# EAGLE schematic Dual_Drive_4 (EAGLE 9.6.2)
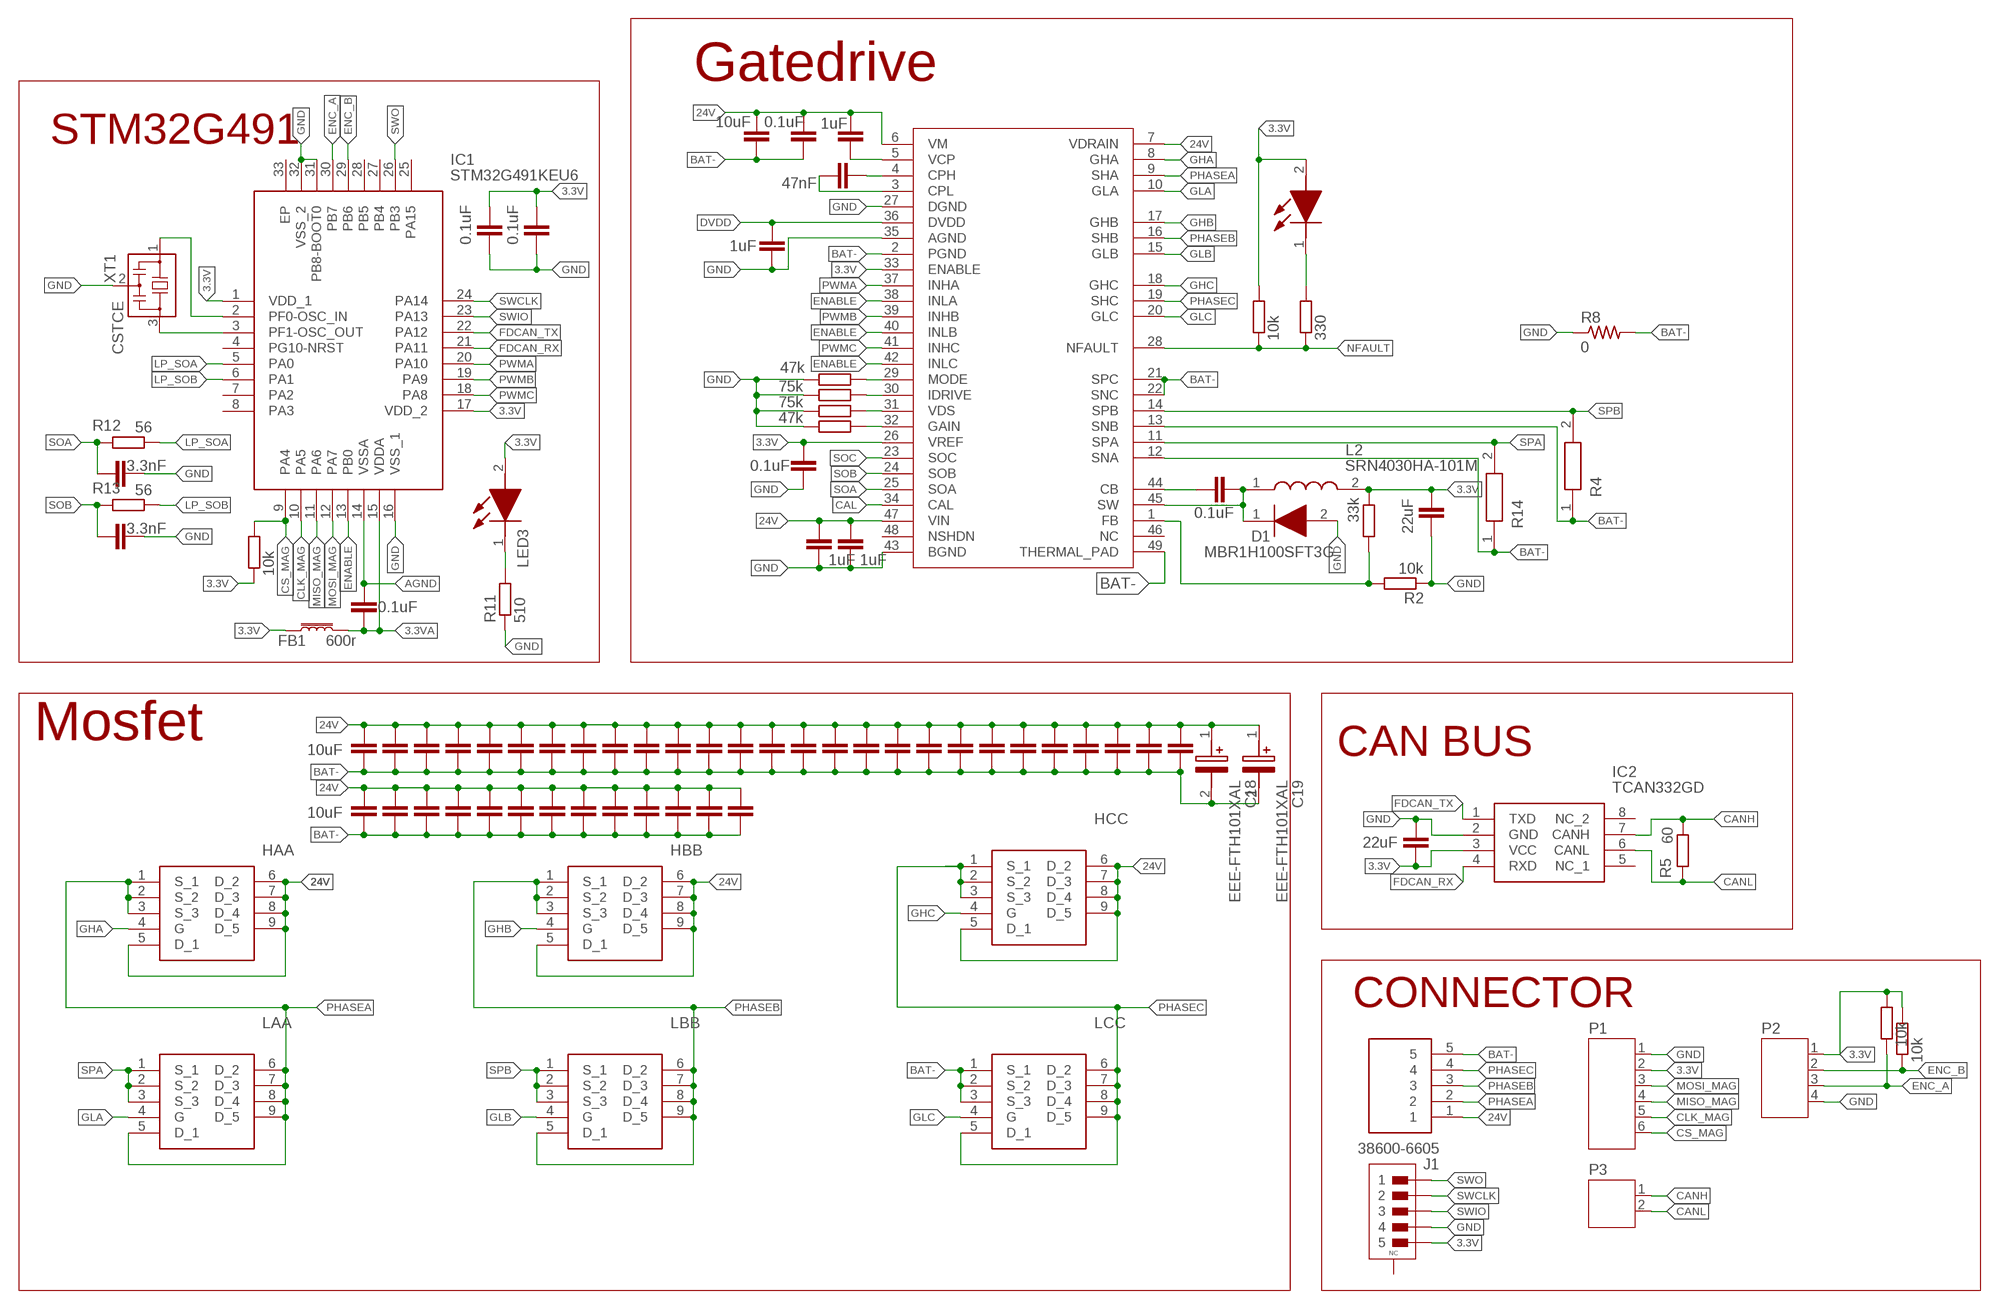
[diagram p0: schematic, sheet 1]

## Parts
C1  3.3nF  C-EUC0603  [C0603]
C2  3.3nF  C-EUC0603  [C0603]
C3  10uF  C-EU1206C1206  [C1206]
C4  22uF  C-EUC0603  [C0603]
C5  10uF  C-EU1206C1206  [C1206]
C6  10uF  C-EU1206C1206  [C1206]
C7  10uF  C-EU1206C1206  [C1206]
C8  10uF  C-EU1206C1206  [C1206]
C9  10uF  C-EU1206C1206  [C1206]
C10  0.1uF  C-EU1206C1206  [C1206]
C11  1uF  C-EUC0603  [C0603]
C12  10uF  C-EU1206C1206  [C1206]
C13  0.1uF  C-EUC0603  [C0603]
C14  1uF  C-EUC0603  [C0603]
C15  0.1uF  C-EUC0603  [C0603]
C16  10uF  C-EU1206C1206  [C1206]
C17  10uF  C-EU1206C1206  [C1206]
C18  EEE-FTH101XAL  [EEEHP1H4R7P]
C19  EEE-FTH101XAL  [EEEHP1H4R7P]
C20  10uF  C-EU1206C1206  [C1206]
C21  10uF  C-EU1206C1206  [C1206]
C22  10uF  C-EU1206C1206  [C1206]
C23  10uF  C-EU1206C1206  [C1206]
C24  10uF  C-EU1206C1206  [C1206]
C25  10uF  C-EU1206C1206  [C1206]
C26  0.1uF  C-EUC0603  [C0603]
C27  0.1uF  C-EUC0603  [C0603]
C28  10uF  C-EU1206C1206  [C1206]
C29  10uF  C-EU1206C1206  [C1206]
C30  0.1uF  C-EUC0603  [C0603]
C31  10uF  C-EU1206C1206  [C1206]
C32  10uF  C-EU1206C1206  [C1206]
C33  10uF  C-EU1206C1206  [C1206]
C34  10uF  C-EU1206C1206  [C1206]
C35  10uF  C-EU1206C1206  [C1206]
C36  10uF  C-EU1206C1206  [C1206]
C37  10uF  C-EU1206C1206  [C1206]
C38  10uF  C-EU1206C1206  [C1206]
C39  10uF  C-EU1206C1206  [C1206]
C40  10uF  C-EU1206C1206  [C1206]
C41  10uF  C-EU1206C1206  [C1206]
C42  10uF  C-EU1206C1206  [C1206]
C43  10uF  C-EU1206C1206  [C1206]
C44  10uF  C-EU1206C1206  [C1206]
C45  47nF  C-EU0805C0805  [C0805]
C46  22uF  C-EUC0603  [C0603]
C47  10uF  C-EU1206C1206  [C1206]
C48  10uF  C-EU1206C1206  [C1206]
C49  10uF  C-EU1206C1206  [C1206]
C50  10uF  C-EU1206C1206  [C1206]
C51  10uF  C-EU1206C1206  [C1206]
C52  10uF  C-EU1206C1206  [C1206]
C53  10uF  C-EU1206C1206  [C1206]
C54  10uF  C-EU1206C1206  [C1206]
C55  10uF  C-EU1206C1206  [C1206]
C56  10uF  C-EU1206C1206  [C1206]
CIN  1uF  C-EUC0603  [C0603]
CIN1  1uF  C-EUC0603  [C0603]
D1  MBR1H100SFT3G  [SODFL3616X98N]
FB1  600r  FERRITE_BEAD-0603  [0603]
HAA  TPH2R506PL,L1Q  [TPHR9003NLL1Q]
HBB  TPH2R506PL,L1Q  [TPHR9003NLL1Q]
HCC  TPH2R506PL,L1Q  [TPHR9003NLL1Q]
IC1  STM32G491KEU6  [QFN50P500X500X60-33N]
IC2  TCAN332GD  [SOIC127P600X175-8N]
IC3  DRV8323RHRGZR  [QFN50P700X700X100-49N]
J1  38600-6605  [386006605]
L2  SRN4030HA-101M  [SRN4030HA101M]
LAA  TPH2R506PL,L1Q  [TPHR9003NLL1Q]
LBB  TPH2R506PL,L1Q  [TPHR9003NLL1Q]
LCC  TPH2R506PL,L1Q  [TPHR9003NLL1Q]
LED1  LTST-C191KRKT  [LEDC1608X55N]
LED3  LTST-C191KRKT  [LEDC1608X55N]
P1  JST-PH6  [JST-PH6]
P2  JST-PH4  [JST-PH4]
P3  JST-PH2  [JST-PH2]
R1  33k  R-EU_R0603  [R0603]
R2  10k  R-EU_R0603  [R0603]
R3  47k  R-EU_R0603  [R0603]
R4  0.01  CRA2512-FZ-R010ELF  [RESC6434X90N]
R5  60  R-EU_R0603  [R0603]
R6  47k  R-EU_R0603  [R0603]
R7  75k  R-EU_R0603  [R0603]
R8  0  R-US_M1206  [M1206]
R10  75k  R-EU_R0603  [R0603]
R11  510  R-EU_R0603  [R0603]
R12  56  R-EU_R0603  [R0603]
R13  56  R-EU_R0603  [R0603]
R14  0.01  CRA2512-FZ-R010ELF  [RESC6434X90N]
RPULL  10k  R-EU_R0603  [R0603]
RPULL1  330  R-EU_R0603  [R0603]
RPULL2  10k  R-EU_R0603  [R0603]
RPULL3  10k  R-EU_R0603  [R0603]
RPULL4  10k  R-EU_R0603  [R0603]
U$3  CON-JST-PH2.0-5PIN-SMD  [CON-JST-PH2.0-5PIN-SMD]
XT1  CSTCE  [CSTCE]

## Nets
3.3V: C4.2 C15.1 C26.1 C27.1 C46.1 FB1.1 IC1.1(VDD_1) IC1.17(VDD_2) IC2.3(VCC) IC3.26(VREF) IC3.33(ENABLE) L2.2 LED1.2(A) LED3.2(A) P1.2 P2.1 R1.2 RPULL2.1 RPULL3.2 RPULL4.2 RPULL.2 U$3.5
3.3VA: C30.1 FB1.2 IC1.15(VDDA)
24V: C3.1 C5.1 C6.1 C7.1 C8.1 C9.1 C10.1 C11.1 C12.1 C16.1 C17.1 C18.1(+) C19.1(+) C20.1 C21.1 C22.1 C23.1 C24.1 C25.1 C28.1 C29.1 C31.1 C32.1 C33.1 C34.1 C35.1 C36.1 C37.1 C38.1 C39.1 C40.1 C41.1 C42.1 C43.1 C44.1 C47.1 C48.1 C49.1 C50.1 C51.1 C52.1 C53.1 C54.1 C55.1 C56.1 CIN1.1 CIN.1 HAA.5(D_1) HAA.6(D_2) HAA.7(D_3) HAA.8(D_4) HAA.9(D_5) HBB.5(D_1) HBB.6(D_2) HBB.7(D_3) HBB.8(D_4) HBB.9(D_5) HCC.5(D_1) HCC.6(D_2) HCC.7(D_3) HCC.8(D_4) HCC.9(D_5) IC3.6(VM) IC3.7(VDRAIN) IC3.47(VIN) J1.1
AGND: C30.2 IC1.14(VSSA)
BAT-: C3.2 C5.2 C6.2 C7.2 C8.2 C9.2 C10.2 C12.2 C16.2 C17.2 C18.2(-) C19.2(-) C20.2 C21.2 C22.2 C23.2 C24.2 C25.2 C28.2 C29.2 C31.2 C32.2 C33.2 C34.2 C35.2 C36.2 C37.2 C38.2 C39.2 C40.2 C41.2 C42.2 C43.2 C44.2 C47.2 C48.2 C49.2 C50.2 C51.2 C52.2 C53.2 C54.2 C55.2 C56.2 IC3.2(PGND) IC3.12(SNA) IC3.13(SNB) IC3.21(SPC) IC3.22(SNC) IC3.49(THERMAL_PAD) J1.5 LCC.1(S_1) LCC.2(S_2) LCC.3(S_3) R4.1 R8.2 R14.1
CAL: IC3.34(CAL)
CANH: IC2.7(CANH) P3.1 R5.1
CANL: IC2.6(CANL) P3.2 R5.2
CB: C13.1 IC3.44(CB)
CLK_MAG: IC1.10(PA5) P1.5
CPH: C45.2 IC3.4(CPH)
CPL: C45.1 IC3.3(CPL)
CS_MAG: IC1.9(PA4) P1.6 RPULL2.2
DVDD: C14.1 IC3.36(DVDD)
ENABLE: IC1.13(PB0) IC3.38(INLA) IC3.40(INLB) IC3.42(INLC)
ENC_A: IC1.30(PB7) P2.3 RPULL4.1
ENC_B: IC1.29(PB6) P2.2 RPULL3.1
FB: IC3.1(FB) R1.1 R2.2
FDCAN_RX: IC1.21(PA11) IC2.4(RXD)
FDCAN_TX: IC1.22(PA12) IC2.1(TXD)
GAIN: IC3.32(GAIN) R3.2
GHA: HAA.4(G) IC3.8(GHA)
GHB: HBB.4(G) IC3.17(GHB)
GHC: HCC.4(G) IC3.18(GHC)
GLA: IC3.10(GLA) LAA.4(G)
GLB: IC3.15(GLB) LBB.4(G)
GLC: IC3.20(GLC) LCC.4(G)
GND: C1.2 C2.2 C4.1 C14.2 C15.2 C26.2 C27.2 C46.2 CIN1.2 CIN.2 D1.2(A) IC1.16(VSS_1) IC1.31(PB8-BOOT0) IC1.32(VSS_2) IC2.2(GND) IC3.27(DGND) IC3.35(AGND) IC3.43(BGND) P1.1 P2.4 R2.1 R3.1 R6.1 R7.1 R8.1 R10.1 R11.1 U$3.4 XT1.2
IDRIVE: IC3.30(IDRIVE) R7.2
LEDFAULT: LED1.1(K) RPULL1.2
LP_SOA: IC1.5(PA0) R12.1
LP_SOB: IC1.6(PA1) R13.1
MISO_MAG: IC1.11(PA6) P1.4
MODE: IC3.29(MODE) R6.2
MOSI_MAG: IC1.12(PA7) P1.3
N$9: IC1.3(PF1-OSC_OUT) XT1.3
N$10: LED3.1(K) R11.2
N$11: IC1.2(PF0-OSC_IN) XT1.1
NFAULT: IC3.28(NFAULT) RPULL1.1 RPULL.1
PHASEA: HAA.1(S_1) HAA.2(S_2) HAA.3(S_3) IC3.9(SHA) J1.2 LAA.5(D_1) LAA.6(D_2) LAA.7(D_3) LAA.8(D_4) LAA.9(D_5)
PHASEB: HBB.1(S_1) HBB.2(S_2) HBB.3(S_3) IC3.16(SHB) J1.3 LBB.5(D_1) LBB.6(D_2) LBB.7(D_3) LBB.8(D_4) LBB.9(D_5)
PHASEC: HCC.1(S_1) HCC.2(S_2) HCC.3(S_3) IC3.19(SHC) J1.4 LCC.5(D_1) LCC.6(D_2) LCC.7(D_3) LCC.8(D_4) LCC.9(D_5)
PWMA: IC1.20(PA10) IC3.37(INHA)
PWMB: IC1.19(PA9) IC3.39(INHB)
PWMC: IC1.18(PA8) IC3.41(INHC)
SOA: C1.1 IC3.25(SOA) R12.2
SOB: C2.1 IC3.24(SOB) R13.2
SOC: IC3.23(SOC)
SPA: IC3.11(SPA) LAA.1(S_1) LAA.2(S_2) LAA.3(S_3) R14.2
SPB: IC3.14(SPB) LBB.1(S_1) LBB.2(S_2) LBB.3(S_3) R4.2
SW: C13.2 D1.1(K) IC3.45(SW) L2.1
SWCLK: IC1.24(PA14) U$3.2
SWIO: IC1.23(PA13) U$3.3
SWO: IC1.26(PB3) U$3.1
VCP: C11.2 IC3.5(VCP)
VDS: IC3.31(VDS) R10.2
Unconnected: IC1.4(PG10-NRST) IC1.7(PA2) IC1.8(PA3) IC1.25(PA15) IC1.27(PB4) IC1.28(PB5) IC1.33(EP) IC2.5(NC_1) IC2.8(NC_2) IC3.46(NC) IC3.48(NSHDN) U$3.NC1(NC) U$3.NC2(NC)

## Notes on the sheet
- Gatedrive
- STM32G491
- Mosfet
- CAN BUS
- CONNECTOR

## Library data of the parts
C1 C2 C26 C27 C30 = rcl:C-EU: CAPACITOR, European symbol; SPICEPREFIX: C
C3 C5-C10 C12 C16 C17 C20-C25 C28 C29 C31-C44 C47-C56 = projectieie:C-EU1206: CAPACITOR, European symbol; SPICEPREFIX: C
C4 C11 C13-C15 C46 CIN CIN1 = projectieie:C-EU: CAPACITOR, European symbol; SPICEPREFIX: C
C18 C19 = EEE-FTH101XAL:EEE-FTH101XAL: Aluminum Electrolytic Capacitors - SMD 50VDC 100uF 20% 6x8mm AEC-Q200 Source: Datasheet <http://industrial.panasonic.com/cdbs/www-data/pdf/RDE0000/RDE0000C1269.pdf>; DESCRIPTION: Aluminum Electrolytic Capacitors - SMD 50VDC 100uF 20% 6x8mm AEC-Q200; HEIGHT: mm; MANUFACTURER_NAME: Panasonic; MANUFACTURER_PART_NUMBER: EEE-FTH101XAL; MOUSER_PART_NUMBER: 667-EEE-FTH101XAL; MOUSER_PRICE-STOCK: https://www.mouser.co.uk/ProductDetail/Panasonic/EEE-FTH101XAL?qs=vmHwEFxEFR%252BNutcOP%252Bqsmw%3D%3D
C45 = projectieie:C-EU0805: CAPACITOR, European symbol; SPICEPREFIX: C
D1 = MBR1H100SFT3G:MBR1H100SFT3G: Diode Schottky 100V 1A SOD123FL ON Semiconductor MBR1H100SFT3G Schottky Diode, 1A, 100V, 2-Pin SOD-123FL Source: Datasheet <http://www.onsemi.com/pub/Collateral/MBR1H100SF-D.PDF>; ARROW_PART_NUMBER: MBR1H100SFT3G; ARROW_PRICE-STOCK: https://www.arrow.com/en/products/mbr1h100sft3g/on-semiconductor; DESCRIPTION: Diode Schottky 100V 1A SOD123FL ON Semiconductor MBR1H100SFT3G Schottky Diode, 1A, 100V, 2-Pin SOD-123FL; HEIGHT: 0.98mm; MANUFACTURER_NAME: ON Semiconductor; MANUFACTURER_PART_NUMBER: MBR1H100SFT3G; MOUSER_PART_NUMBER: 863-MBR1H100SFT3G; MOUSER_PRICE-STOCK: https://www.mouser.co.uk/ProductDetail/ON-Semiconductor/MBR1H100SFT3G?qs=0n%252BW%2FEG%252BKm6mjS2tdY4y%2FA%3D%3D
FB1 = SparkFun-Coils:FERRITE_BEAD: Ferrite Bead (blocks, cores, rings, chokes, etc.) Inductor with layers of ferrite used to suppress high frequencies. Often used to isolate high frequency noise. SparkFun Products: IOIO-OTG - V2.2 <https://www.sparkfun.com/products/13613> SparkFun SAMD21 Mini Breakout <https://www.sparkfun.com/products/13664> SparkFun 6 Degrees of Freedom Breakout - LSM6DS3 <https://www.sparkfun.com/products/13339> SparkFun SAMD21 Dev Breakout <https://www.sparkfun.com/products/13672>; PROD_ID: NDUC-13805; VALUE: 30Ω/1.8A
HAA HBB HCC LAA LBB LCC = TPH2R506PL_L1Q:TPH2R506PL,L1Q: MOSFET N-Ch 60V 4180pF 60nC 160A 132W Source: Datasheet <http://toshiba.semicon-storage.com/info/docget.jsp?did=55522&prodName=TPH2R506PL>; ARROW_PART_NUMBER: TPH2R506PL,L1Q; ARROW_PRICE-STOCK: https://www.arrow.com/en/products/tph2r506pll1q/toshiba; DESCRIPTION: MOSFET N-Ch 60V 4180pF 60nC 160A 132W; HEIGHT: 1mm; MANUFACTURER_NAME: Toshiba; MANUFACTURER_PART_NUMBER: TPH2R506PL,L1Q; MOUSER_PART_NUMBER: 757-TPH2R506PLL1Q; MOUSER_PRICE-STOCK: https://www.mouser.co.uk/ProductDetail/Toshiba/TPH2R506PLL1Q?qs=bUPhaerQQeFGJjj6SxbPEQ%3D%3D
IC1 = STM32G491KEU6:STM32G491KEU6: MCU 32-bit ARM Cortex M4 RISC 512KB Flash 1.8V/2.5V/3.3V 32-Pin UFQFPN EP Tray Source: Datasheet <https://www.st.com/resource/en/datasheet/stm32g491ke.pdf>; ARROW_PART_NUMBER: STM32G491KEU6; ARROW_PRICE-STOCK: https://www.arrow.com/en/products/stm32g491keu6/stmicroelectronics?region=nac; DESCRIPTION: MCU 32-bit ARM Cortex M4 RISC 512KB Flash 1.8V/2.5V/3.3V 32-Pin UFQFPN EP Tray; HEIGHT: 0.6mm; MANUFACTURER_NAME: STMicroelectronics; MANUFACTURER_PART_NUMBER: STM32G491KEU6; MOUSER_PART_NUMBER: 511-STM32G491KEU6; MOUSER_PRICE-STOCK: https://www.mouser.co.uk/ProductDetail/STMicroelectronics/STM32G491KEU6?qs=eP2BKZSCXI6Ifx0U7HNJyA%3D%3D
IC2 = TCAN332GD:TCAN332GD: 3.3-V CAN Transceivers with CAN FD (Flexible Data Rate) Source: Datasheet <http://www.ti.com/lit/gpn/tcan332g>; ARROW_PART_NUMBER: TCAN332GD; ARROW_PRICE-STOCK: https://www.arrow.com/en/products/tcan332gd/texas-instruments?region=nac; DESCRIPTION: 3.3-V CAN Transceivers with CAN FD (Flexible Data Rate); HEIGHT: 1.75mm; MANUFACTURER_NAME: Texas Instruments; MANUFACTURER_PART_NUMBER: TCAN332GD; MOUSER_PART_NUMBER: 595-TCAN332GD; MOUSER_PRICE-STOCK: https://www.mouser.co.uk/ProductDetail/Texas-Instruments/TCAN332GD?qs=n%252BTO0c4TDSYoXh39%2FoLTXQ%3D%3D
IC3 = projectieie:DRV8323RHRGZR: 60V Three-Phase Smart Gate Driver With Buck Regulator and Three Current Shunt Amplifiers Source: Datasheet <http://www.ti.com/lit/gpn/drv8323r>; ARROW_PART_NUMBER: DRV8323RHRGZR; ARROW_PRICE-STOCK: https://www.arrow.com/en/products/drv8323rhrgzr/texas-instruments; DESCRIPTION: 60V Three-Phase Smart Gate Driver With Buck Regulator and Three Current Shunt Amplifiers; HEIGHT: 1mm; MANUFACTURER_NAME: Texas Instruments; MANUFACTURER_PART_NUMBER: DRV8323RHRGZR; MOUSER_PART_NUMBER: 595-DRV8323RHRGZR; MOUSER_PRICE-STOCK: https://www.mouser.co.uk/ProductDetail/Texas-Instruments/DRV8323RHRGZR?qs=Mv7BduZupUj%2FALPfD5cVcg%3D%3D
J1 = 38600-6605:38600-6605: Barrier Terminal Blocks SR BTS CS PC 5ASYCP Source: Datasheet <https://www.mouser.com/datasheet/2/276/0386006605_TERMINAL_BLOCKS-138538.pdf>; DESCRIPTION: Barrier Terminal Blocks SR BTS CS PC 5ASYCP; HEIGHT: 12.7mm; MANUFACTURER_NAME: Molex; MANUFACTURER_PART_NUMBER: 38600-6605; MOUSER_PART_NUMBER: 538-38600-6605; MOUSER_PRICE-STOCK: https://www.mouser.com/Search/Refine.aspx?Keyword=538-38600-6605
L2 = SRN4030HA-101M:SRN4030HA-101M: Ind,4x4x3mm,100uH+/-20%,0.55A,150C,shd Source: Datasheet <https://www.bourns.com/docs/product-datasheets/SRN4030HA.pdf>; DESCRIPTION: Ind,4x4x3mm,100uH+/-20%,0.55A,150C,shd; HEIGHT: 3mm; MANUFACTURER_NAME: Bourns; MANUFACTURER_PART_NUMBER: SRN4030HA-101M
LED1 LED3 = LTST-C191KRKT:LTST-C191KRKT: Standard LEDs - SMD Red Clear 631nm Source: Datasheet <http://www.mouser.com/ds/2/239/S_110_LTST-C191KRKT-539838.pdf>; ARROW_PART_NUMBER: LTST-C191KRKT; ARROW_PRICE-STOCK: https://www.arrow.com/en/products/ltst-c191krkt/lite-on-technology; DESCRIPTION: Standard LEDs - SMD Red Clear 631nm; HEIGHT: 0.55mm; MANUFACTURER_NAME: Lite-On; MANUFACTURER_PART_NUMBER: LTST-C191KRKT; MOUSER_PART_NUMBER: 859-LTST-C191KRKT; MOUSER_PRICE-STOCK: https://www.mouser.co.uk/ProductDetail/Lite-On/LTST-C191KRKT?qs=BAIUz4Y8PJBLfOhzue0q%252BA%3D%3D
P1 = jst-ph:JST-PH6
P2 = jst-ph:JST-PH4
P3 = jst-ph:JST-PH2
R1 R2 RPULL RPULL1-RPULL4 = projectieie:R-EU_: RESISTOR, European symbol; SPICEPREFIX: R
R3 R5-R7 R10-R13 = rcl:R-EU_: RESISTOR, European symbol; SPICEPREFIX: R
R4 R14 = CRA2512-FZ-R010ELF:CRA2512-FZ-R010ELF: Bourns CRA Series High Power Surface Mount Resistor 2512 Case 10m +/-1% 3W +/-75ppm/C Source: Datasheet <http://www.bourns.com/PDFs/CRA.pdf>; ARROW_PART_NUMBER: CRA2512-FZ-R010ELF; ARROW_PRICE-STOCK: https://www.arrow.com/en/products/cra2512-fz-r010elf/bourns; DESCRIPTION: Bourns CRA Series High Power Surface Mount Resistor 2512 Case 10m +/-1% 3W +/-75ppm/C; HEIGHT: 0.9mm; MANUFACTURER_NAME: Bourns; MANUFACTURER_PART_NUMBER: CRA2512-FZ-R010ELF; MOUSER_PART_NUMBER: 652-CRA2512FZR010ELF; MOUSER_PRICE-STOCK: https://www.mouser.co.uk/ProductDetail/Bourns/CRA2512-FZ-R010ELF?qs=WqWCsLCZBkoNPiv%2FXVnYvw%3D%3D
R8 = rcl:R-US_: RESISTOR, American symbol; SPICEPREFIX: R
U$3 = con-jst-ph2.0:CON-JST-PH2.0-5PIN-SMD
XT1 = sc_usercreated:CSTCE